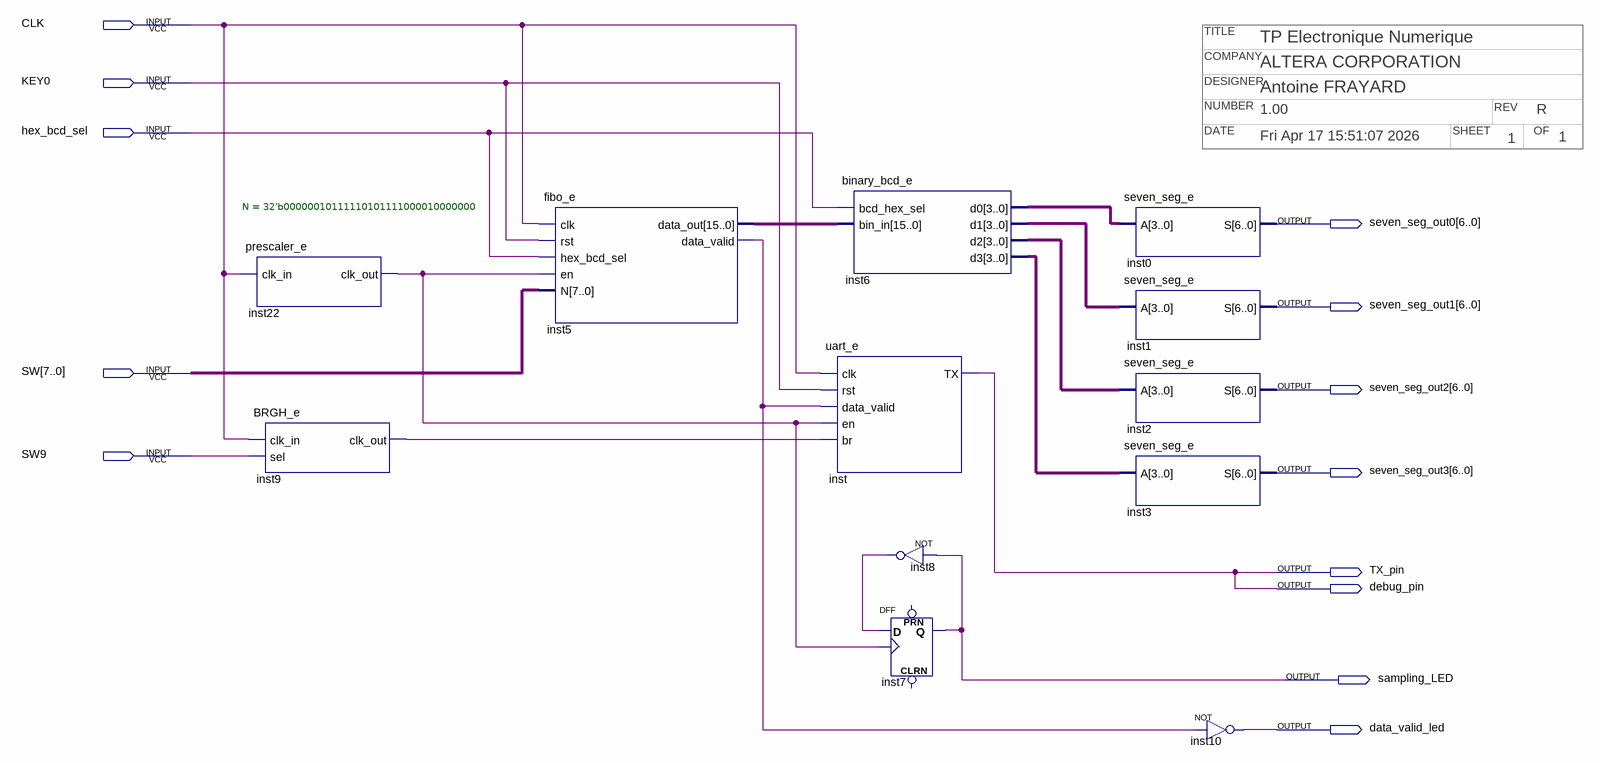
[diagram p0: schematic sheet]
// Quartus schematic TP_elec_num.bdf as structural Verilog: 12 symbols, 13 pins
// Title block: COMPANY: ALTERA CORPORATION; DATE: Fri Apr 17 15:51:07 2026; DESIGNER: Antoine FRAYARD; NUMBER: 1.00; OF: 1; REV: R; SHEET: 1; TITLE: TP Electronique Numerique
module TP_elec_num (
  input  CLK,
  input  KEY0,
  input  hex_bcd_sel,
  input  [7:0] SW,
  input  SW9,
  output [6:0] seven_seg_out0,
  output [6:0] seven_seg_out1,
  output [6:0] seven_seg_out2,
  output [6:0] seven_seg_out3,
  output TX_pin,
  output debug_pin,
  output sampling_LED,
  output data_valid_led
);

  wire inst5_data_valid, inst8_out, inst9_clk_out, inst22_clk_out;
  wire [3:0] inst6_d0, inst6_d1, inst6_d2, inst6_d3;
  wire [15:0] inst5_data_out;

  prescaler_e #(.N(32'b00000010111110101111000010000000)) inst22 (.clk_in(CLK), .clk_out(inst22_clk_out));
  BRGH_e inst9 (.clk_in(CLK), .sel(SW9), .clk_out(inst9_clk_out));
  fibo_e inst5 (
    .clk(CLK), .rst(KEY0), .hex_bcd_sel(hex_bcd_sel), .en(inst22_clk_out), .N(SW), .data_out(inst5_data_out),
    .data_valid(inst5_data_valid));
  binary_bcd_e inst6 (
    .bcd_hex_sel(hex_bcd_sel), .bin_in(inst5_data_out), .d0(inst6_d0), .d1(inst6_d1), .d2(inst6_d2),
    .d3(inst6_d3));
  uart_e inst (
    .clk(CLK), .rst(KEY0), .data_valid(inst5_data_valid), .en(inst22_clk_out), .br(inst9_clk_out),
    .TX(debug_pin));
  not inst8 (inst8_out, sampling_LED);
  DFF inst7 (.CLK(inst22_clk_out), .D(inst8_out), .Q(sampling_LED));  // open: CLRN, PRN
  seven_seg_e inst0 (.A(inst6_d0), .S(seven_seg_out0));
  seven_seg_e inst1 (.A(inst6_d1), .S(seven_seg_out1));
  seven_seg_e inst2 (.A(inst6_d2), .S(seven_seg_out2));
  seven_seg_e inst3 (.A(inst6_d3), .S(seven_seg_out3));
  not inst10 (data_valid_led, inst5_data_valid);

  assign TX_pin = debug_pin;
endmodule
